# Altium project LED.PrjPcb
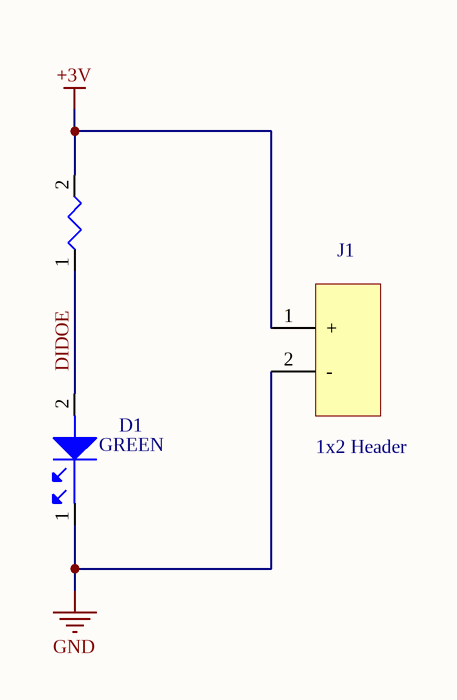
[diagram p0: LED.SchDoc]
1 sheet, 3 parts. Net scope: global (net labels, ports and power ports of the same name join across sheets).
Board file: LED.PcbDoc

## Sheet LED.SchDoc
size A4; SheetNumber: 1; SheetTotal: 1

### Parts
D1  GREEN  [LED0603G]
J1  1x2 Header  [HDR1x2]
R1  360R  [R0805]  (value not drawn)

### Nets
+3V: J1.1(+) R1.2
GND: D1.1 J1.2(-)
DIDOE: D1.2 R1.1

### Library data of the parts
D1 = LNJ337W83RA: Standard LEDs - SMD LED GR HI-BRT USS; Manufacturer: Panasonic SSG; Colour: Green,Yellow; Luminous Intensity: 7.5mcd; Forward Voltage: 1.95V; Wavelength: 572nm; Forward Current: 20mA; Test Current: 5mA; Lens Style: Rectangular; Number of LEDs: 1; Max Power Dissipation: 55mW; Reverse Voltage: 4V; Supplier 1: Digi-Key; Supplier Part Number 1: LNJ337W83RADKR-ND; Manufacturer Part Number: LNJ337W83RA; Stock 1: 200597; Pricing 1: 1=0.48, 10=0.343, 25=0.28, 100=0.2239, 250=0.18888, 500=0.1609, 1000=0.12593, 2500=0.11544 (USD); Mount: Surface Mount; Case/Package: 0603; Number of Pins: 2; Case Code (Metric): 1608; Case Code (Imperial): 0603; Min Operating Temperature: -30°C; Max Operating Temperature: 85°C; Package Quantity: 1; Packaging: Tape and Reel; Illumination Colour: Green; Dominant Wavelength: 572nm; Length: 1.6mm; Height: 0.2mm; Width: 0.8mm; REACH SVHC: Yes; Lead Free: Lead Free; ComponentLink1URL: https://datasheet.ciiva.com/6868/lnj337w83ra-aek-6868817.pdf; ComponentLink1Description: https://datasheet.ciiva.com/6868/lnj337w83ra-aek-6868817.pdf; ComponentLink2URL: https://datasheet.ciiva.com/4690/lnj337w83ra-aek-226051-4690026.pdf; ComponentLink2Description: https://datasheet.ciiva.com/4690/lnj337w83ra-aek-226051-4690026.pdf; ComponentLink3URL: https://datasheet.ciiva.com/11775/0900766b80f0a8bb-11775418.pdf; ComponentLink3Description: https://datasheet.ciiva.com/11775/0900766b80f0a8bb-11775418.pdf; Category: Optoelectronics
J1 = 0022292021: KK 254 Wire-to-Board Header, Vertical, with Friction Lock, 2 Circuits, Gold (Au) Plating; Manufacturer: Molex; Supplier: Digikey; Supplier Part Number: WM2744-ND; Manufacturer Part Number: 0022292021; RoHS: No; Stock: 117221; Pricing: 1=0.34, 10=0.286, 100=0.2225, 3000=0.18654 (USD); ComponentLink1URL: https://datasheet.octopart.com/22-29-2021-Molex-datasheet-33002381.pdf?src-supplier=Newark; ComponentLink1Description: https://datasheet.octopart.com/22-29-2021-Molex-datasheet-33002381.pdf?src-supplier=Newark; ComponentLink2URL: https://datasheet.octopart.com/22-29-2021-Molex-datasheet-144804.pdf?src-supplier=Digikey; ComponentLink2Description: https://datasheet.octopart.com/22-29-2021-Molex-datasheet-144804.pdf?src-supplier=Digikey; Category: Connectors
R1 = CRCW0805360RFKEA: SMD Chip Resistor, 360 Ohm, ± 1%, 125 mW, 0805 [2012 Metric], Thick Film, General Purpose; Manufacturer: Vishay; Voltage Rating (DC): 150V; Supplier: Mouser; Supplier Part Number: 71-CRCW0805360RFKEA; Manufacturer Part Number: CRCW0805360RFKEA; RoHS: Yes; Category: Chip SMD Resistors; Stock: 6377; Pricing: 1=0.1, 10=0.025, 50=0.025, 100=0.015, 1000=0.012, 10000=0.008 (USD); Reach SVHC Compliant: 4187SVHC; ComponentLink1URL: https://datasheet.ciiva.com/2467/dcrcwe3-2467773.pdf?src-supplier=Digikey; ComponentLink1Description: https://datasheet.ciiva.com/2467/dcrcwe3-2467773.pdf?src-supplier=Digikey; Caterogy: Resistor